# EAGLE board Flight-Mill-Battery (EAGLE 9.6.2)
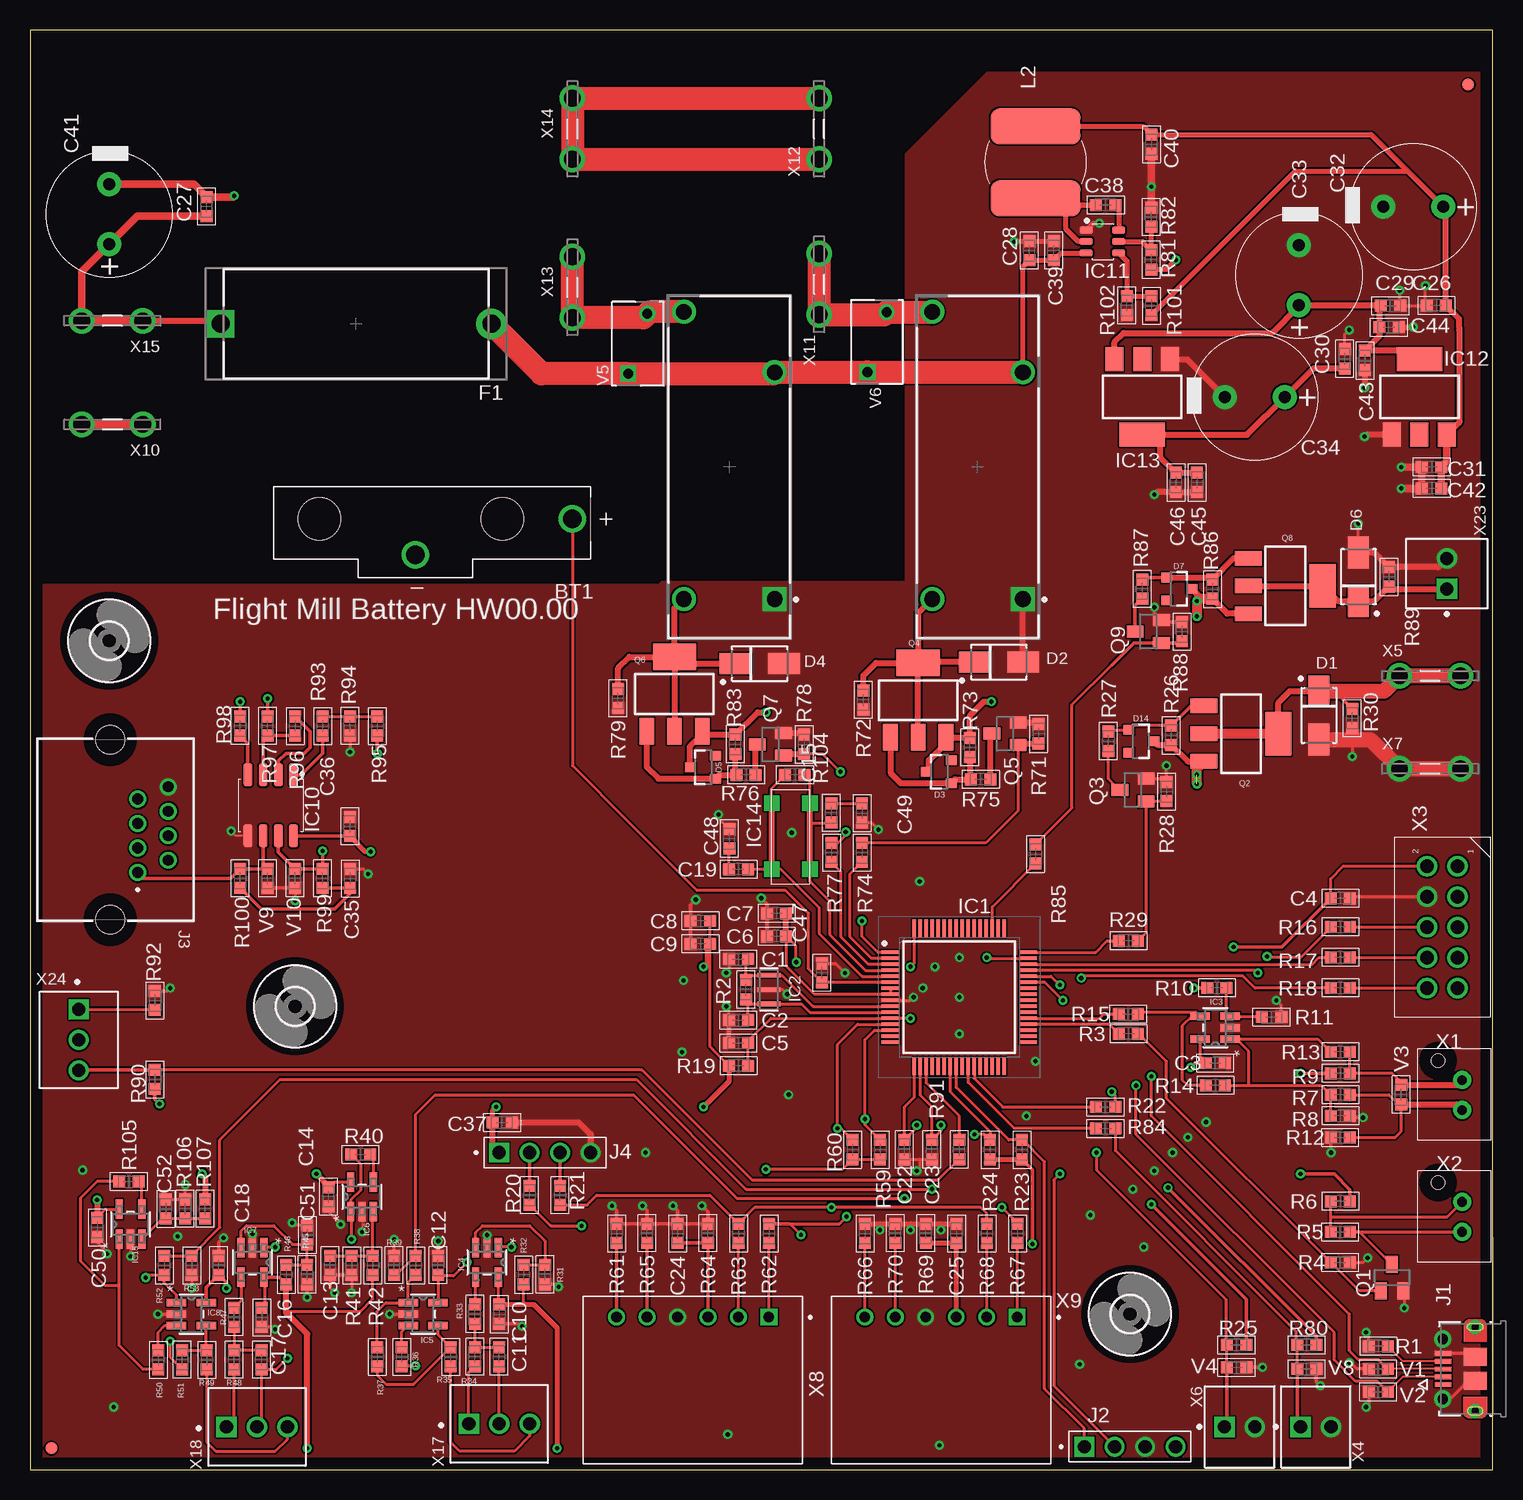
[diagram p5: board, top side]
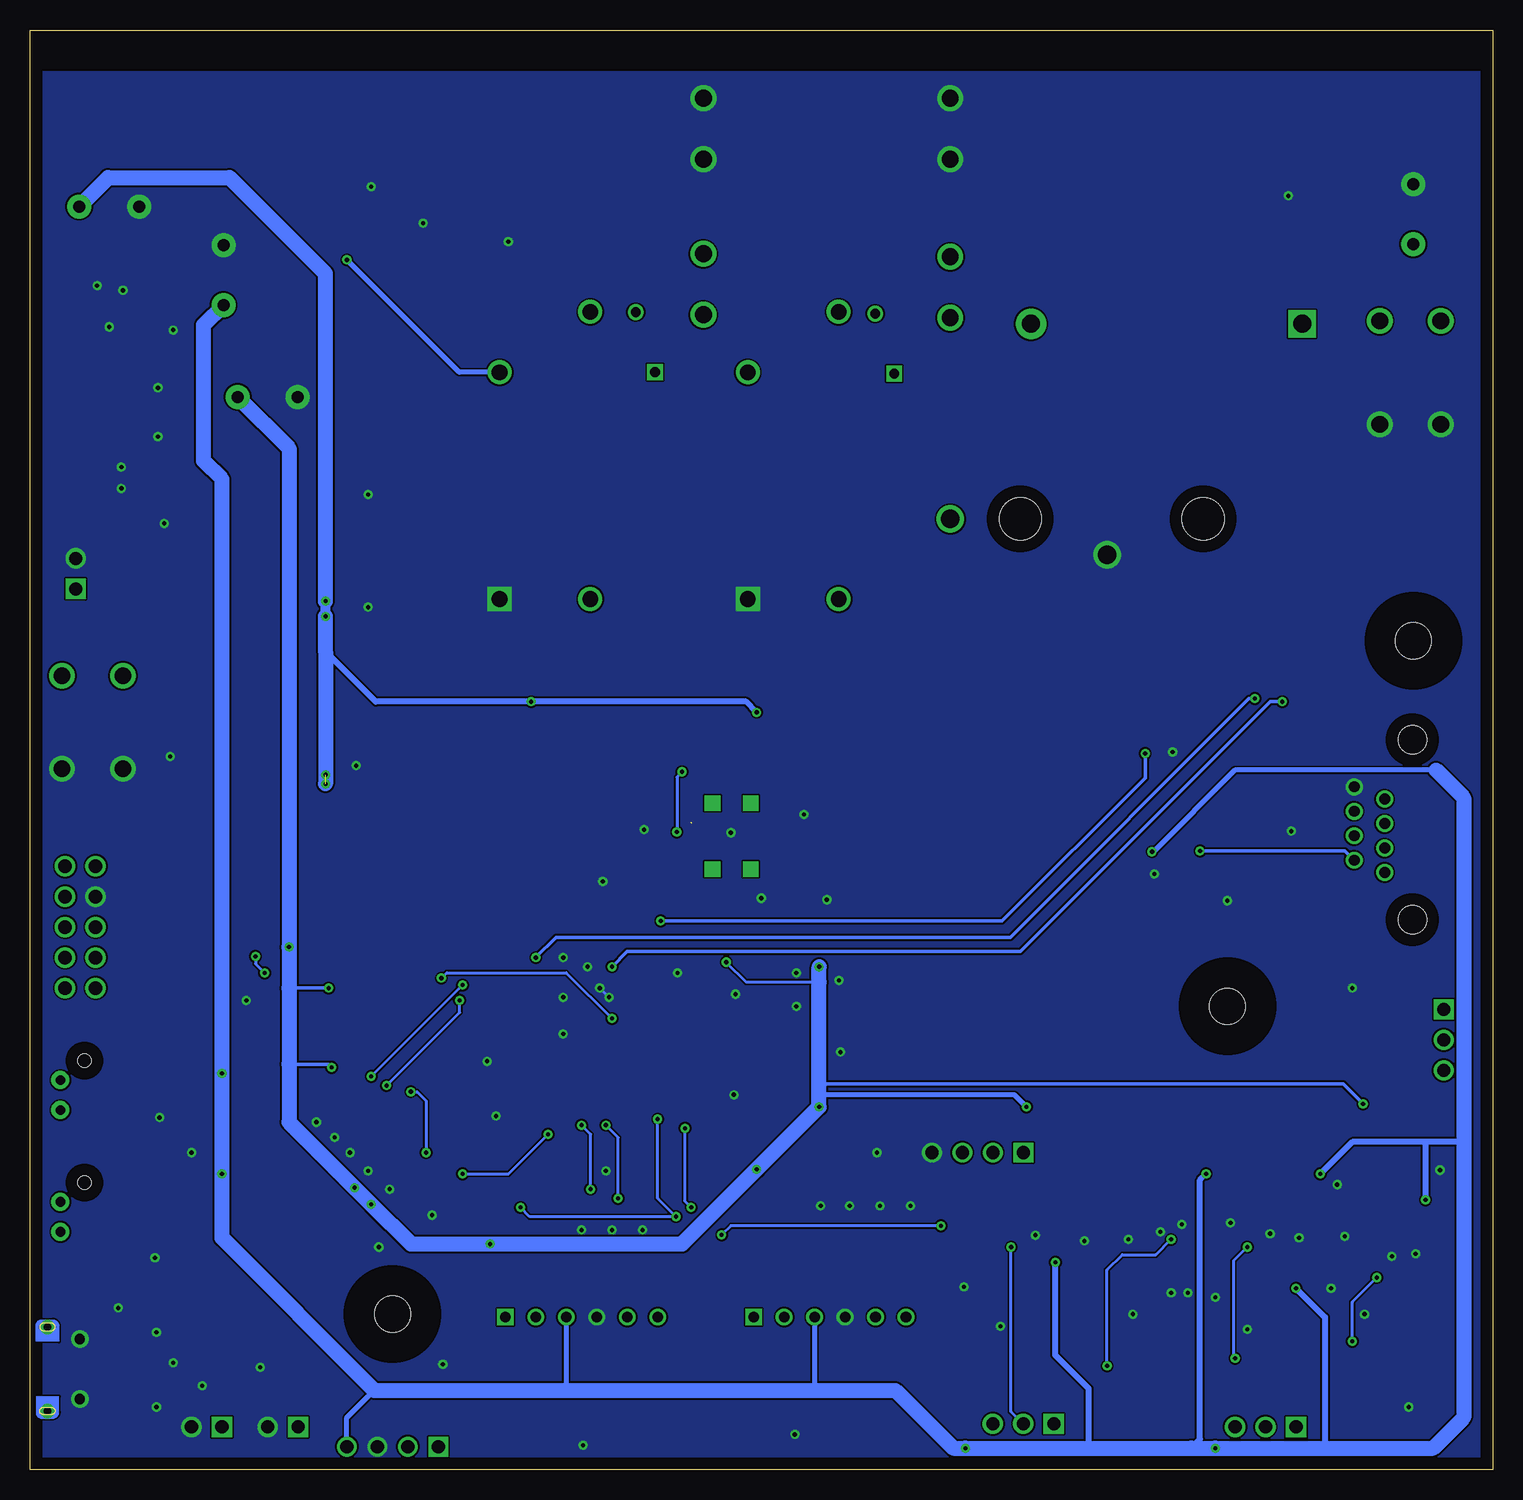
[diagram p6: board, bottom side, seen from below]

Size 121.92 x 120 mm. Coordinates in mm from the lower left corner, seen from the top.
Outline: 0,0 121.92,0 121.92,120 0,120 0,0
Copper layers (1*16): Top 0.035mm / dielectric 1.5mm / Bottom 0.035mm
Design rules "default *": minimum track width 6mil, minimum drill 0.35mm, track to track 6mil, track to pad 6mil, pad to pad 6mil, via to via 6mil, smd to smd 6mil, copper to edge 40mil, drill to drill 6mil, minimum pad ring 10mil, minimum via ring 8mil, stop-mask expansion 4mil, vias tented up to drill 0.8mm, thermal gap 10mil
Net classes: 0 default: clearance 0.152 mm; 1 Mains_N: clearance 8 mm to class 0, clearance 0.152 mm; 2 Mains_L: clearance 8 mm to class 0, clearance 3.2 mm to class 1, clearance 0.152 mm; 3 LV: clearance 0.152 mm to class 0, clearance 8 mm to class 1

## Footprints (pad centres in the part's own frame; a part is rotated, then mirrored left to right if it is on the bottom)
BAT_1065 = drill 1.52: N -0.38,3; P -13.46,0 | hole 3.5: -7.62,0; 7.62,0
EIA0603 = smd 1 x 1: 1 -0.8,0; 2 0.8,0
CAPACITOR-ELKO-RM5-10X16 = drill 1 pad 2: 1 -2.5,0; 2 2.5,0
SMA = smd 2.65 x 1.75: 1 -2.015,0; 2 2.015,0
SOT23-3 = smd 0.8 x 0.9: 1 -0.95,-1; 2 0.95,-1; 3 0,1.1
FUSE_RM22.6 = drill 1.5 pad 2.3 square: 1 -11.3,0 | drill 1.5 pad 2.54: 2 11.3,0
FIDUCIAL = smd 1 x 1: P$1 0,0
3,0 = hole 3: 0,0
QFP50P1200X1200X160-64N = smd 1.475 x 0.3: 1 -5.738,3.75; 2 -5.738,3.25; 3 -5.738,2.75; 4 -5.738,2.25; 5 -5.738,1.75; 6 -5.738,1.25; 7 -5.738,0.75; 8 -5.738,0.25; 9 -5.738,-0.25; 10 -5.738,-0.75; 11 -5.738,-1.25; 12 -5.738,-1.75; 13 -5.738,-2.25; 14 -5.738,-2.75; 15 -5.738,-3.25; 16 -5.738,-3.75; 33 5.738,-3.75; 34 5.738,-3.25; 35 5.738,-2.75; 36 5.738,-2.25; 37 5.738,-1.75; 38 5.738,-1.25; 39 5.738,-0.75; 40 5.738,-0.25; 41 5.738,0.25; 42 5.738,0.75; 43 5.738,1.25; 44 5.738,1.75; 45 5.738,2.25; 46 5.738,2.75; 47 5.738,3.25; 48 5.738,3.75 | smd 0.3 x 1.475: 17 -3.75,-5.738; 18 -3.25,-5.738; 19 -2.75,-5.738; 20 -2.25,-5.738; 21 -1.75,-5.738; 22 -1.25,-5.738; 23 -0.75,-5.738; 24 -0.25,-5.738; 25 0.25,-5.738; 26 0.75,-5.738; 27 1.25,-5.738; 28 1.75,-5.738; 29 2.25,-5.738; 30 2.75,-5.738; 31 3.25,-5.738; 32 3.75,-5.738; 49 3.75,5.738; 50 3.25,5.738; 51 2.75,5.738; 52 2.25,5.738; 53 1.75,5.738; 54 1.25,5.738; 55 0.75,5.738; 56 0.25,5.738; 57 -0.25,5.738; 58 -0.75,5.738; 59 -1.25,5.738; 60 -1.75,5.738; 61 -2.25,5.738; 62 -2.75,5.738; 63 -3.25,5.738; 64 -3.75,5.738
CSTNE8M00G520000R0 = smd 0.4 x 1.9: 1 -1.2,0; 2 0,0; 3 1.2,0
SOT-23-5 = smd 1.626 x 0.61: 1 -1.245,0.95; 2 -1.245,0; 3 -1.245,-0.95; 4 1.245,-0.95; 5 1.245,0.95
SOIC8 = smd 1.9 x 0.72: 1 -2.54,1.905; 2 -2.54,0.635; 3 -2.54,-0.635; 4 -2.54,-1.905; 5 2.54,-1.905; 6 2.54,-0.635; 7 2.54,0.635; 8 2.54,1.905
SOT23-6 = smd 0.6 x 1.1: 1 -0.95,-1.35; 2 0,-1.35; 3 0.95,-1.35; 4 0.95,1.35; 5 0,1.35; 6 -0.95,1.35
SOT223 = smd 1.5 x 2: 1 -2.3,-3.15; 2 0,-3.15; 3 2.3,-3.15 | smd 3.8 x 2: 4 0,3.15
G43270019 = drill 0 pad 1.3 square: 1 0,0; 2 5.5,0; 3 5.5,3.2; 4 0,3.2
MOLEX_1050170001 = smd 0.4 x 1.35: 1 -1.3,4.125; 2 -0.65,4.125; 3 0,4.125; 4 0.65,4.125; 5 1.3,4.125 | drill 0.85 pad 1.45: SH1 -2.5,4.15; SH2 2.5,4.15 | drill 0.6 pad 1.2: SH3 -3.5,1.45; SH6 3.5,1.45 | smd 1.5 x 1.9: SH4 -1,1.45; SH5 1,1.45
X04_100MIL_1ROW = drill 1.1 pad 1.45 square: 01 -3.81,0 | drill 1.1 pad 1.45: 02 -1.27,0; 03 1.27,0; 04 3.81,0
615008148521 = drill 0.9: 1 3.57,1.875; 2 2.55,4.415; 3 1.53,1.875; 4 0.51,4.415; 5 -0.51,1.875; 6 -1.53,4.415; 7 -2.55,1.875; 8 -3.57,4.415 | hole 2.36: -7.5,-0.425; 7.5,-0.425
RYA31012 = drill 1.3 pad 2: 11 7.9,-3.78; 14 12.94,3.78; A2 -11,3.78 | drill 1.3 pad 2 square: A1 -11,-3.78
SRN8040TA-220M = smd 3 x 7.5: 1 -3,0; 2 3,0
SOT23 = smd 1 x 1.4: 1 -0.95,-1.1; 2 0.95,-1.1; 3 0,1.1
SOT223' = smd 1.219 x 2.235: 1 -2.311,-3.099; 2 0,-3.099; 3 2.311,-3.099 | smd 3.6 x 2.2: 4 0,3.099
EPCOS_B72205S0271K101_0 = drill 0.8 pad 1.3 square: 1 -2.5,0.8 | drill 0.8 pad 1.3: 2 2.5,-0.8
B2B-XH-AM(LF)(SN) = drill 0.8 pad 1.5: 1 0,0; 2 2.5,0 | hole 1.1: 4.1,2
X10_100MIL_2XROW_VERT = drill 1.1 pad 1.7: 1 -5.08,1.27; 2 -5.08,-1.27; 3 -2.54,1.27; 4 -2.54,-1.27; 5 0,1.27; 6 0,-1.27; 7 2.54,1.27; 8 2.54,-1.27; 9 5.08,1.27; 10 5.08,-1.27
TE_282834-2_0 = drill 1.1 pad 1.7 square: 1 -1.27,0 | drill 1.1 pad 1.7: 2 1.27,0
TE_726386-2 = drill 1.4 pad 2.15: 1 -2.54,0; 1-2 2.54,0
TE_5-102203-3 = drill 0.889 square: 1 0,0 | drill 0.889: 2 2.54,0; 3 5.08,0; 4 7.62,0; 5 10.16,0; 6 12.7,0
TE_282834-3_0 = drill 1.1 pad 1.7 square: 1 0,2.54 | drill 1.1 pad 1.7: 2 0,0; 3 0,-2.54

## Placement (x,y rotation side)
BT1  1065  [BAT_1065]  31.75,79.25 180 top
C1  10pF/50V  [EIA0603]  59.05,42.55 0 top
C2  10pF/50V  [EIA0603]  59.05,37.47 0 top
C3  100nF/50V  [EIA0603]  98.81,33.91 0 top
C4  100nF/50V  [EIA0603]  109.22,47.62 180 top
C5  100nF/50V  [EIA0603]  59.05,35.56 0 top
C6  1uF/25V  [EIA0603]  62.23,44.45 180 top
C7  100nF/50V  [EIA0603]  62.23,46.35 180 top
C8  1uF/25V  [EIA0603]  55.88,45.72 180 top
C9  100nF/50V  [EIA0603]  55.88,43.81 180 top
C10  100nF/50V  [EIA0603]  39.12,12.95 270 top
C11  0R 1%  [EIA0603]  39.12,9.4 90 top
C12  100nF/50V  [EIA0603]  34.04,17.02 90 top
C13  100nF/50V  [EIA0603]  25.02,17.02 90 top
C14  100nF/50V  [EIA0603]  24.89,22.73 90 top
C15  10pF/50V  [EIA0603]  66.8,54.74 90 top
C16  100nF/50V  [EIA0603]  19.3,12.7 270 top
C17  0R 1%  [EIA0603]  19.3,9.14 90 top
C18  100nF/50V  [EIA0603]  15.75,17.02 90 top
C19  10pF/50V  [EIA0603]  59.05,50.04 180 top
C22  100nF/50V  [EIA0603]  72.9,26.67 90 top
C23  100nF/50V  [EIA0603]  75.18,26.67 90 top
C24  100nF/50V  [EIA0603]  53.98,19.68 270 top
C25  100nF  [EIA0603]  77.22,19.68 270 top
C26  100nF 100V  [EIA0603]  117.22,97.03 180 top
C27  100nF 100V  [EIA0603]  14.73,105.28 90 top
C28  100nF 100V  [EIA0603]  83.31,101.6 90 top
C29  100nF 100V  [EIA0603]  113.41,97.03 0 top
C30  100nF 100V  [EIA0603]  109.6,92.58 90 top
C31  100nF 100V  [EIA0603]  116.84,83.57 180 top
C32  50PX470MEFC10X20  [CAPACITOR-ELKO-RM5-10X16]  115.32,105.28 180 top
C33  50PX470MEFC10X20  [CAPACITOR-ELKO-RM5-10X16]  105.79,99.57 90 top
C34  50PX470MEFC10X20  [CAPACITOR-ELKO-RM5-10X16]  102.11,89.41 180 top
C35  100pF 100V  [EIA0603]  26.67,49.28 270 top
C36  100nF/50V  [EIA0603]  26.67,53.59 90 top
C37  100nF/50V  [EIA0603]  39.37,28.96 0 top
C38  100nF 100V  [EIA0603]  89.66,105.41 180 top
C39  1uF/35V  [EIA0603]  85.34,101.6 90 top
C40  100nF 100V  [EIA0603]  93.47,110.49 270 top
C41  50PX470MEFC10X20  [CAPACITOR-ELKO-RM5-10X16]  6.6,104.65 90 top
C42  1uF/35V  [EIA0603]  116.84,81.79 180 top
C43  100nF 100V  [EIA0603]  111.25,92.46 270 top
C44  1uF/35V  [EIA0603]  113.28,95.25 0 top
C45  100nF 100V  [EIA0603]  97.28,82.3 270 top
C46  1uF/35V  [EIA0603]  95.5,82.3 270 top
C47  100nF/50V  [EIA0603]  66.04,41.4 90 top
C48  10pF/50V  [EIA0603]  58.29,52.58 90 top
C49  10pF/50V  [EIA0603]  69.34,54.74 270 top
C50  100nF/50V  [EIA0603]  5.59,20.19 270 top
C51  100nF/50V  [EIA0603]  23.11,19.56 270 top
C52  100nF/50V  [EIA0603]  11.3,21.72 270 top
D1  SS14  [SMA]  107.44,62.87 270 top
D2  SS14  [SMA]  80.77,67.31 0 top
D3  MMBZ4696-HE3-18  [SOT23-3]  75.82,58.17 90 top
D4  SS14  [SMA]  60.83,67.18 0 top
D5  MMBZ4696-HE3-18  [SOT23-3]  56.13,58.55 90 top
D6  SS14  [SMA]  110.74,74.42 90 top
D7  MMBZ4696-HE3-18  [SOT23-3]  95.76,73.41 270 top
D14  MMBZ4696-HE3-18  [SOT23-3]  92.58,60.71 270 top
F1  696101000002  [FUSE_RM22.6]  27.18,95.5 0 top
FID1  FIDUCIAL  [FIDUCIAL]  119.89,115.44 0 top
FID2  FIDUCIAL  [FIDUCIAL]  1.78,1.78 0 top
H1  MOUNT-HOLE3.0  [3,0]  91.69,12.95 0 top
H2  MOUNT-HOLE3.0  [3,0]  6.6,69.09 0 top
H3  MOUNT-HOLE3.0  [3,0]  22.1,38.61 0 top
IC1  STM32G0B1RET6  [QFP50P1200X1200X160-64N]  77.47,39.37 0 top
IC2  CSTNE8M00G520000R0  [CSTNE8M00G520000R0]  61.59,40.01 270 top
IC3  MCP6001UT  [SOT-23-5]  98.81,36.83 180 top
IC4  LMV641  [SOT-23-5]  38.1,17.27 270 top
IC5  LMV641  [SOT-23-5]  32.77,12.95 0 top
IC6  LMV641  [SOT-23-5]  27.69,22.73 90 top
IC7  LMV641  [SOT-23-5]  18.54,17.27 270 top
IC8  LMV641  [SOT-23-5]  13.46,12.95 0 top
IC10  SN65HVD3082EDR  [SOIC8]  20.07,55.37 270 top
IC11  TPS54202DDCR  [SOT23-6]  89.41,102.36 270 top
IC12  LD117AS50TR  [SOT223]  115.82,89.41 0 top
IC13  LD117AS33TR  [SOT223]  92.71,89.41 180 top
IC14  G43270019  [G43270019]  65.02,50.04 90 top
IC15  LMV641  [SOT-23-5]  8.38,20.45 90 top
J1  1050170001  [MOLEX_1050170001]  121.92,8.38 90 top
J2  61300411121  [X04_100MIL_1ROW]  91.69,1.91 0 top
J3  615008148521  [615008148521]  7.11,53.34 270 top
J4  61300411121  [X04_100MIL_1ROW]  42.93,26.42 0 top
K1  RYA31012  [RYA31012]  78.99,83.57 90 top
K2  RYA31012  [RYA31012]  58.29,83.57 90 top
L2  SRN8040TA-220M  [SRN8040TA-220M]  83.82,108.97 90 top
Q1  BC817  [SOT23]  113.54,16 0 top
Q2  UT2955G-AA3-R  [SOT223']  100.97,61.34 270 top
Q3  2N7002  [SOT23]  91.95,56.64 90 top
Q4  UT2955G-AA3-R  [SOT223']  74.04,64.14 0 top
Q5  2N7002  [SOT23]  81.28,61.34 90 top
Q6  UT2955G-AA3-R  [SOT223']  53.72,64.64 0 top
Q7  2N7002  [SOT23]  61.72,60.45 90 top
Q8  UT2955G-AA3-R  [SOT223']  104.65,73.66 270 top
Q9  2N7002  [SOT23]  93.22,69.85 90 top
R1  100K 1%  [EIA0603]  112.39,10.29 180 top
R2  n.P  [EIA0603]  59.69,40.01 90 top
R3  470R 1%  [EIA0603]  91.57,36.32 180 top
R4  4.7K 1%  [EIA0603]  109.22,17.27 0 top
R5  10K 1%  [EIA0603]  109.22,19.81 0 top
R6  330R 1%  [EIA0603]  109.22,22.35 180 top
R7  47K 1%  [EIA0603]  109.22,31.24 180 top
R8  47K 1%  [EIA0603]  109.22,29.46 180 top
R9  33R 1%  [EIA0603]  109.22,33.02 180 top
R10  10K 1%  [EIA0603]  98.93,40.13 180 top
R11  10K 1%  [EIA0603]  103.5,37.72 0 top
R12  1K 1%  [EIA0603]  109.22,27.69 0 top
R13  n.p  [EIA0603]  109.22,34.8 180 top
R14  100K 1%  [EIA0603]  98.81,32 180 top
R15  100R 1%  [EIA0603]  91.57,37.97 0 top
R16  100R 1%  [EIA0603]  109.22,45.21 180 top
R17  100R 1%  [EIA0603]  109.22,42.67 180 top
R18  100R 1%  [EIA0603]  109.22,40.13 180 top
R19  10K 1%  [EIA0603]  59.05,33.66 180 top
R20  0R 1%  [EIA0603]  41.66,22.86 90 top
R21  0R 1%  [EIA0603]  44.2,22.86 90 top
R22  100R 1%  [EIA0603]  89.66,30.23 0 top
R23  10K 1%  [EIA0603]  82.68,26.67 270 top
R24  10K 1%  [EIA0603]  80.01,26.67 270 top
R25  10k 1%  [EIA0603]  100.58,10.41 0 top
R26  10K 1%  [EIA0603]  95.12,61.21 270 top
R27  10K 1%  [EIA0603]  89.92,60.71 90 top
R28  10K 1%  [EIA0603]  94.74,56.52 270 top
R29  100R 1%  [EIA0603]  91.57,44.07 180 top
R30  10K 1%  [EIA0603]  110.24,62.61 90 top
R31  10K 1%  [EIA0603]  42.93,16.26 90 top
R32  10K 1%  [EIA0603]  41.15,16.26 270 top
R33  100R 1%  [EIA0603]  37.08,12.95 90 top
R34  100R 1%  [EIA0603]  37.08,9.4 90 top
R35  100R 1%  [EIA0603]  35.05,9.4 270 top
R36  100R 1%  [EIA0603]  30.99,9.4 270 top
R37  10K 1%  [EIA0603]  28.96,9.4 270 top
R38  10K 1%  [EIA0603]  32.13,17.02 270 top
R39  n.P  [EIA0603]  30.35,17.02 90 top
R40  10R 1%  [EIA0603]  27.56,26.29 0 top
R41  2.49KK 1%  [EIA0603]  26.8,17.02 270 top
R42  2.49K 1%  [EIA0603]  28.57,17.02 270 top
R45  10K 1%  [EIA0603]  23.11,16.26 90 top
R46  10K 1%  [EIA0603]  21.34,16.26 270 top
R47  10K 1%  [EIA0603]  17.02,12.7 90 top
R48  10K 1%  [EIA0603]  17.02,9.14 90 top
R49  100R 1%  [EIA0603]  14.73,9.14 270 top
R50  100R 1%  [EIA0603]  10.67,9.14 270 top
R51  10K 1%  [EIA0603]  12.7,9.14 90 top
R52  10k 1%  [EIA0603]  11.18,17.02 270 top
R53  n.P  [EIA0603]  13.46,17.02 270 top
R59  10K 1%  [EIA0603]  70.87,26.67 270 top
R60  10K 1%  [EIA0603]  68.58,26.67 270 top
R61  0R 1%  [EIA0603]  48.9,19.68 270 top
R62  0R 1%  [EIA0603]  61.59,19.68 270 top
R63  0R 1%  [EIA0603]  59.05,19.68 270 top
R64  10K 1%  [EIA0603]  56.52,19.68 90 top
R65  10K  [EIA0603]  51.44,19.68 90 top
R66  0R 1%  [EIA0603]  69.6,19.68 270 top
R67  0R 1%  [EIA0603]  82.3,19.68 270 top
R68  0R 1%  [EIA0603]  79.76,19.68 270 top
R69  10K 1%  [EIA0603]  74.68,19.68 90 top
R70  10K  [EIA0603]  72.14,19.68 90 top
R71  10K 1%  [EIA0603]  84.07,61.34 270 top
R72  10K 1%  [EIA0603]  69.47,64.14 90 top
R73  10K 1%  [EIA0603]  78.36,60.2 90 top
R74  100R 1%  [EIA0603]  69.34,51.44 270 top
R75  10K 1%  [EIA0603]  79.25,57.53 180 top
R76  10K 1%  [EIA0603]  59.69,57.91 180 top
R77  100R 1%  [EIA0603]  66.8,51.44 270 top
R78  10K 1%  [EIA0603]  64.52,60.45 270 top
R79  10K 1%  [EIA0603]  49.02,64.26 90 top
R80  10k 1%  [EIA0603]  106.43,10.41 0 top
R81  1k 1%  [EIA0603]  93.47,100.84 90 top
R82  10k 1%  [EIA0603]  93.47,104.39 90 top
R83  10K 1%  [EIA0603]  58.8,60.45 90 top
R84  100R 1%  [EIA0603]  89.66,28.45 0 top
R85  100R 1%  [EIA0603]  83.82,51.31 270 top
R86  10K 1%  [EIA0603]  98.55,73.41 270 top
R87  10K 1%  [EIA0603]  92.71,73.41 90 top
R88  10K 1%  [EIA0603]  96.01,69.85 270 top
R89  10K 1%  [EIA0603]  113.28,74.42 270 top
R90  1K 1%  [EIA0603]  10.41,32.51 270 top
R91  100R 1%  [EIA0603]  77.47,26.67 90 top
R92  0R 1%  [EIA0603]  10.41,39.12 270 top
R93  1K 1%  [EIA0603]  24.38,61.98 270 top
R94  1.8K 1%  [EIA0603]  26.67,61.98 90 top
R95  470R 1%  [EIA0603]  28.96,61.98 270 top
R96  0R 1%  [EIA0603]  22.1,61.98 270 top
R97  470R 1%  [EIA0603]  19.81,61.98 90 top
R98  470R 1%  [EIA0603]  17.53,61.98 90 top
R99  100R 1%  [EIA0603]  24.38,49.28 90 top
R100  100R 1%  [EIA0603]  17.53,49.28 90 top
R101  100k 1%  [EIA0603]  93.47,97.03 270 top
R102  4.3K 1%  [EIA0603]  91.44,97.03 90 top
R104  22k 1%  [EIA0603]  63.75,57.91 180 top
R105  10R 1%  [EIA0603]  8.26,24 0 top
R106  2.49K 1%  [EIA0603]  12.95,21.72 90 top
R107  2.49K 1%  [EIA0603]  14.61,21.72 90 top
V1  0603ESDA-24NSMD  [EIA0603]  112.39,8.38 0 top
V2  0603ESDA-24NSMD  [EIA0603]  112.39,6.48 0 top
V3  0603ESDA-24NSMD  [EIA0603]  114.3,31.24 90 top
V4  0603ESDA-24NSMD  [EIA0603]  100.58,8.51 0 top
V5  B72205S0271K101B72205S2131K101  [EPCOS_B72205S0271K101_0]  50.67,93.85 90 top
V6  B72205S0271K101B72205S2131K101  [EPCOS_B72205S0271K101_0]  70.61,93.98 90 top
V8  0603ESDA-24NSMD  [EIA0603]  106.43,8.38 0 top
V9  0603ESDA-24NSMD  [EIA0603]  19.81,49.28 90 top
V10  0603ESDA-24NSMD  [EIA0603]  22.1,49.28 90 top
X1  B2B-XH-AM(LF)(SN)  [B2B-XH-AM(LF)(SN)]  119.38,29.97 90 top
X2  B2B-XH-AM(LF)(SN)  [B2B-XH-AM(LF)(SN)]  119.38,19.81 90 top
X3  WF2549-2WS05S0B01  [X10_100MIL_2XROW_VERT]  117.73,45.21 270 top
X4  282834-2  [TE_282834-2_0]  107.19,3.56 0 top
X5  726386-2TE_726386-2  [TE_726386-2]  116.71,66.17 0 top
X6  282834-2  [TE_282834-2_0]  100.84,3.56 0 top
X7  726386-2TE_726386-2  [TE_726386-2]  116.71,58.42 0 top
X8  5-102203-3  [TE_5-102203-3]  61.59,12.7 180 top
X9  5-102203-3  [TE_5-102203-3]  82.3,12.7 180 top
X10  726386-2TE_726386-2  [TE_726386-2]  6.86,87.12 180 top
X11  726386-2TE_726386-2  [TE_726386-2]  65.79,98.81 90 top
X12  726386-2TE_726386-2  [TE_726386-2]  65.79,111.76 90 top
X13  726386-2TE_726386-2  [TE_726386-2]  45.21,98.55 90 top
X14  726386-2TE_726386-2  [TE_726386-2]  45.21,111.76 90 top
X15  726386-2TE_726386-2  [TE_726386-2]  6.86,95.76 180 top
X17  282834-3  [TE_282834-3_0]  39.12,3.81 90 top
X18  282834-3  [TE_282834-3_0]  18.92,3.56 90 top
X23  282834-2  [TE_282834-2_0]  118.11,74.68 90 top
X24  282834-3  [TE_282834-3_0]  4.06,35.81 0 top

## Tracks (layer width: path | path; a pad name or v marks a point on that pad's centre or on a via)
AI_O2_SENSOR
  Top 0.254: R37.1 28.96,13.21 29.65,13.9 IC5.1 31.52,15.61 R38.2
AI_O2_SENSOR1  (via drill 0.35)
  Top 0.254: 30.61,16.22 R39.1 30.53,16.22 R38.1 32.13,29.59 33.78,31.24 50.29,31.24 58.93,22.61 v72.9,22.61 | IC1.17 73.72,31.05 72.9,30.23 C22.2 73.91,28.49 v73.91,28.7
  Bottom 0.254: v72.9,22.61 72.9,27.69 v73.91,28.7
AI_O2_SENSOR2  (via drill 0.35)
  Top 0.254: R52.1 R53.1 15.83,20.19 15.83,27.48 20.87,32.51 50.55,32.51 59.69,23.37 v75.18,23.37 | IC1.18 74.22,31.19 75.18,30.23 C23.2 75.95,28.23 v75.95,28.7
  Bottom 0.254: v75.95,28.7 75.18,27.94 v75.18,23.37
AIR_PUMP+
  Top 0.305: R30.2 108.77,64.88 D1.1
  Top 0.508: Q2.4 104.06,63.93 105.01,64.88 D1.1
  Top 0.813: Q2.2 Q2.4
  Top 1.27: X5.1 X5.1-2 | 114.17,65.77 X5.1 | D1.1 112.89,64.88 X5.1
CO2_SCL  (via drill 0.35)
  Top 0.254: R60.1 67.6,28.45 v67.31,28.45 67.31,35.43 69,37.12 IC1.13 | R68.1 79.76,21.34 79.25,21.84 v66.8,21.84 60.41,21.84 R63.1 56.68,22.86 47.24,22.86 46.44,22.06 R21.1
  Bottom 0.254: v66.8,21.84 67.31,22.35 v67.31,28.45
CO2_SDA  (via drill 0.35)
  Top 0.254: v68.07,21.08 67.47,20.48 R62.1 63.34,20.48 v64.26,19.56 | R59.1 69.6,28.74 v69.6,29.21 69.6,35.81 70.4,36.62 IC1.14 | v81.03,21.84 82.3,20.57 R67.1 | R20.1 43.4,20.32 v45.97,20.32
  Bottom 0.254: v69.6,29.21 69.6,22.61 v68.07,21.08 80.26,21.08 v81.03,21.84 | v45.97,20.32 63.5,20.32 v64.26,19.56
DGB_SWDCLK_TCK
  Top 0.254: IC1.46 106.89,42.12 107.44,42.67 R17.2
DGB_SWDIO_TMS  (via drill 0.35)
  Top 0.254: R16.2 108.42,45.17 105.92,42.67 103.12,42.67 v103.12,42.78 | v102.36,41.4 102.14,41.62 IC1.45
  Bottom 0.254: v103.12,42.78 103.12,42.16 v102.36,41.4
DI_PULSE1
  Top 0.254: IC1.37 88.14,37.59 89.15,37.59 89.53,37.97 R15.1
DI_PUSHBUTTON1
  Top 0.254: IC1.27 78.72,32.6 81.09,30.23 R22.1
DI_PUSHBUTTON2
  Top 0.254: R84.1 82.04,28.45 78.22,32.27 IC1.26
DI_USART_RX  (via drill 0.35)
  Top 0.254: IC1.1 70.67,43.12 69.34,44.45 v69.34,45.72
  Top 0.305: R95.2 v28.96,59.69
  Bottom 0.305: v28.96,59.69 28.96,57.66 40.89,45.72 v69.34,45.72
DO_AIR_PUMP_ON
  Top 0.254: IC1.48 88.84,43.12 89.79,44.07 R29.2
DO_FAN_ON
  Top 0.254: IC1.51 80.22,46.91 R85.2
DO_HEATER_ON
  Top 0.254: IC1.2 70.16,42.62 68.33,44.45 68.33,49.62 R74.2
DO_HUMIDIFIER_ON
  Top 0.254: IC1.3 69.89,42.12 67.56,44.45 67.56,49.87 R77.2
DO_IR_TX
  Top 0.254: R3.2 89.97,37.12 IC1.36
DO_USART_TX  (via drill 0.35)
  Top 0.254: v73.41,41.91 73.72,42.22 IC1.64
  Top 0.305: R98.2 v17.53,64.01
  Bottom 0.305: v73.41,41.91 72.14,43.18 39.37,43.18 18.54,64.01 v17.53,64.01
DO_USART_TX_EN  (via drill 0.35)
  Top 0.254: 79.81,42.62 IC1.47
  Top 0.305: v79.76,42.67 79.81,42.62 | R97.2 v19.81,64.26
  Bottom 0.305: v79.76,42.67 78.05,44.37 40.21,44.37 20.32,64.26 v19.81,64.26
FAN+
  Top 0.508: X23.1 113.5,73.41 R89.2 112.07,72.41 D6.1 109,72.41 Q8.4 Q8.2
GND  (via drill 0.35)
  Top 0.152: IC10.5 17.14,52.83 v16.76,53.21 | IC6.2 v27.69,19.81
  Top 0.254: C4.1 110.15,47.75 X3.4 | C2.1 58.26,38.39 v58.04,38.61 | C1.1 58.26,41.62 v58.04,41.4 | IC2.2 62.74,40.01 v63.12,39.62 | C22.1 74.17,25.87 | 74.17,25.87 C23.1 | 74.17,25.87 74.17,25.15 v73.91,24.89 | V2.1 111.59,5.42 v111.38,5.21 | V1.1 110.62,8.38 110.11,8.89 v109.98,8.89 | R1.2 111.59,11.21 v111.38,11.43 | Q1.2 114.55,14.84 v114.55,13.46 | R4.2 111.12,17.27 v111.51,17.65 | R11.2 104.31,38.7 v103.89,39.12 | R28.1 94.74,57.4 | 94.74,57.4 v94.74,58.67 | Q3.2 94.55,57.59 94.74,57.4 | 110.11,60.85 110.24,60.72 v110.24,59.44 | v116.33,98.68 116.33,97.12 C26.2 C29.2 114.17,97.07 v114.17,98.3 | C30.2 109.6,94.61 v109.98,95 | D6.2 v110.74,78.87 | C35.1 27.77,50.08 v28.19,49.66 | V10.1 v22.1,47.42 22.1,47.37 | R92.1 11.47,39.92 v11.68,40.13 | R53.2 v13.46,15.11 | R94.1 v26.67,59.82 | IC1.9 73.41,39.12 v73.66,39.37 | C47.2 67.14,42.2 v67.94,41.4 | C49.2 70.14,53.94 v70.74,53.34 | C50.2 5.59,18.92 6.48,18.03 v6.41,17.97 | IC15.2 v8.38,17.78 | C52.1 R106.2 | R106.2 | R106.2 v12.95,23.75 | C14.1 24.89,21.46 v25.91,20.45 | C51.1 22.06,20.36 v21.84,20.57 | R41.2 C13.1 25.02,15.11 v25.4,14.73 | R41.2 | R41.2 v26.8,14.73 | R39.2 v30.35,19.18 | C48.2 57.4,54.27 v57.4,54.61
  Top 0.305: V9.1 V10.1 | J1.5 120.17,9.68 J1.SH5 | J1.SH1 118.4,5.88 119.9,7.38 J1.SH4 | R31.1 43.85,15.46 v44.07,15.24 | C10.2 40.8,12.15 v41.02,11.94 | IC5.2 v29.97,12.95 | v34.04,19.05 C12.2 | R45.1 v23.11,14.35 | C16.2 20.23,11.9 v20.45,11.68 | IC8.2 v10.67,12.95 | v16.13,19.3 15.75,18.92 C18.2 | IC7.2 v18.54,19.66 18.54,19.68 | V4.2 v102.74,8.51 | V8.2 107.23,7.33 v107.57,6.99 | R12.1 108.42,26.45 v108.46,26.42 | R8.1 110.15,29.34 v111.12,29.34 | C6.2 C7.2 61.43,47.16 v60.96,47.62 | C9.2 C8.2 55.08,47.08 v55.5,47.5 | R64.2 R61.1 48.9,21.59 v48.51,21.97 | R64.2 | C24.1 53.98,21.59 v53.59,21.97 | R64.2 56.52,21.46 v56.01,21.97 | R65.2 51.44,21.59 v51.05,21.97 | IC4.2 v38.1,19.54 38.1,19.56 | R88.1 94.47,70.65 Q9.2 93.73,71.39 v93.73,71.88
  Top 0.406: C5.1 C2.1 | R66.1 70.87,20.48 | 70.87,20.48 73.41,20.48 | 73.41,20.48 75.82,20.48 | 75.82,20.48 C25.1 | 70.87,20.48 v70.87,19.96 70.87,19.94 | 73.41,20.48 v73.41,19.96 73.41,19.94 | 75.82,20.48 75.95,20.36 v75.95,19.96 75.95,19.94 | IC11.1 88.63,103.89 v89.15,103.89 | C39.2 C28.2 83.27,102.36 v82.04,102.36
  Top 0.508: K1.A1 82.79,72.55 D2.2 | Q5.2 83.92,62.29 R71.1 | Q7.2 64.37,61.4 R78.1 | X23.2 117.39,75.22 R89.1 112.07,76.44 D6.2 | C37.2 45.72,28.96 46.74,27.94 J4.04 | IC12.1 111.4,86.26 v111.25,86.11 | IC13.1 96.46,92.56 C34.2 | C45.2 C46.2 93.94,81.5 v93.73,81.28 | C43.2 v111.25,90.17 | C44.2 v115.32,95.25
  Top 0.61: C41.2 13.67,107.15 C27.2 16.93,106.08 v17.02,106.17 | X10.1-2 X10.1 | R82.2 v93.47,106.93 C40.2 | v114.3,83.57 C31.2 C42.2 v114.3,81.79
  Top 1.27: X7.1-2 X7.1 111.74,60.85 110.11,60.85 D1.2
  Top 1.905: X12.1 X14.1 X14.1-2 X12.1-2
  Bottom 0.254: v73.66,39.37 v74.42,40.13
  other vias: 75.44,41.91 77.47,39.37 77.47,42.67 77.47,36.32 51.31,26.42 63.25,31.24 74.17,49.02 83.06,29.46 91.95,23.37 93.73,24.89 95.25,26.42 96.52,27.69 98.04,28.96 54.36,34.8 54.48,40.77 83.82,34.04 88.39,21.21 92.84,18.54 87.5,8.76 75.82,2.03 58.17,2.92 6.99,5.21 12.32,19.43 4.38,24.96 63.5,53.09
  pour Top (no thermals): 0.38,73.79 52.45,73.79 52.7,74.04 73.03,74.04 73.03,109.67 79.81,116.46 121.28,116.46 121.28,0.64 121.03,0.38 0.89,0.38 0.38,0.89
  pour Bottom (no thermals): 0.38,0.89 0.38,116.46 121.28,116.46 121.28,0.64 121.03,0.38 0.89,0.38
HEATER+
  Top 1.905: X11.1-2 X11.1 71.2,96.27 V6.2 75.19,96.48 K1.14
HUMIDIFIER+
  Top 1.905: K2.14 51.63,96.51 V5.2 51.13,96.01 X13.1 X13.1-2
IR_DIODE_A
  Top 0.254: R5.1 108.42,21.08 | 108.42,21.08 R6.2 | R6.2 | 108.42,21.08 118.15,21.08 X2.2
IR_DIODE_C
  Top 0.254: X2.1 R5.2 110.83,19.81 Q1.3
IR_TR_NPN_C
  Top 0.254: 114.55,32.04 113.58,33.02 R9.1 R13.1
  Top 0.508: V3.2 114.55,32.04 118.95,32.04 X1.2
IR_TR_NPN_E
  Top 0.254: 110.02,30.77 R7.1 113.28,31.24 114.08,30.44 V3.1 114.3,28.19 113.79,27.69 R12.2
  Top 0.508: V3.1 118.91,30.44 X1.1
LCD_SCL
  Top 0.254: J2.01 87.88,3.43 84.58,6.73 84.58,25.65 82.77,27.47 R23.1 81.58,27.47 77.22,31.83 IC1.24
LCD_SDA  (via drill 0.35)
  Top 0.254: J2.02 85.34,6.99 85.34,24.13 v85.85,24.64 85.85,24.68 | v78.74,27.94 79.54,27.94 R24.1 80.01,28.19 76.72,31.48 IC1.23
  Bottom 0.254: v85.85,24.64 82.04,24.64 v78.74,27.94
N$1
  Top 0.254: R16.1 X3.6
N$2
  Top 0.254: R27.2 90.07,61.66 D14.1 91.99,62.06 95.17,62.06
  Top 0.305: R26.1 95.17,62.06 96.76,63.65 Q2.1
N$3
  Top 0.254: C1.2 59.69,42.38 R2.2 60.09,41.2 IC2.1 62.68,41.2 65.28,38.61 71.72,38.61 IC1.10
N$4
  Top 0.152: J1.4 114.45,9.03 R1.1
N$5
  Top 0.254: IC1.11 71.71,38.1 65.02,38.1 64.32,38.8 IC2.3 60.09,38.8 R2.1 59.85,39.04 C2.2
N$6
  Top 0.254: R8.2 R7.2 107.66,32 101.6,32 | R13.2 107.34,35.88 IC3.1 100.56,35.88 101.6,34.84 101.6,32 | R14.1 101.6,32
N$7
  Top 0.254: 108.42,17.23 R4.1 | Q1.1 110.83,14.9 108.46,17.27 R4.1 | R4.1 94.74,30.95 94.74,34.04 92.46,36.32 R3.1
N$8
  Top 0.254: R11.1 102.64,37.78 IC3.3 99.73,38.1 R10.1
N$9
  Top 0.254: Q3.3 89.92,57.57 R27.1
N$10
  Top 0.254: R14.2 96.52,32 96.08,32.45 96.08,37.02 96.84,37.78 IC3.4 97.24,38.1 92.49,38.1 R15.2
N$11
  Top 0.254: R17.1 X3.8
N$12
  Top 0.254: R29.1 93.05,44.75 Q3.1 93.07,55.72 R28.2
N$13
  Top 0.254: R18.1 X3.10
N$14
  Top 0.152: R35.1 35.03,10.22
  Top 0.254: IC5.4 34.01,11.24 R35.1 32,7.15 32,7.11 29.68,7.11 28.96,7.84 R37.2
N$15
  Top 0.254: IC6.4 28.64,26.01 R40.2
N$16
  Top 0.254: R33.1 R34.2 C11.2
N$17
  Top 0.254: 37.15,13.82 R33.2 37.08,15.96 IC4.4
N$18  (via drill 0.35)
  Top 0.254: R40.1 27.56,25.49 27.56,23.29 26.74,22.46 IC6.1 26.8,21.43 v26.8,19.18 | R36.2 31.03,8.64 v32.13,8.64
  Bottom 0.254: v32.13,8.64 32.13,16.64 30.86,17.91 28.07,17.91 v26.8,19.18
N$19
  Top 0.254: R36.1 30.99,11.47 IC5.3
N$20
  Top 0.254: C19.2 58.26,51.74 C48.1
N$21
  Top 0.254: R42.1 | R42.1 28.38,18.01 | R42.1 28.57,17.91 | 28.57,17.91 28.57,21.43 IC6.3 | C13.2 R41.1 | R41.1 | R41.1 28.49,17.82 28.57,17.91
N$23
  Top 0.254: C17.2 R48.2 R47.1
N$24
  Top 0.254: IC7.4 17.59,14.07 R47.2
N$25
  Top 0.254: R49.1 14.71,9.97 IC8.4 | R51.2 R49.1 | R49.1
N$27
  Top 0.254: IC15.3 11.05,20.92 C52.2 R106.1 | R106.1 | R106.1 R107.1
N$32  (via drill 0.35)
  Top 0.254: IC8.1 12.22,14.54 11.18,15.58 R52.2 | R52.2 | R51.1 11.68,9.36 v11.68,10.68 | v11.68,10.68 | v9.65,16 9.87,16.22 R52.2
  Bottom 0.254: v11.68,10.68 11.68,13.97 v9.65,16
N$33
  Top 0.305: X8.6 R61.2
N$34
  Top 0.254: X8.1 R62.2
N$35
  Top 0.254: X8.2 R63.2
N$36
  Top 0.305: X8.5 R65.1
N$37
  Top 0.254: X9.6 R66.2
N$38
  Top 0.254: X9.1 R67.2
N$39
  Top 0.254: X9.2 R68.2
N$40
  Top 0.254: X9.5 R70.1
N$41
  Top 0.508: Q4.1 71.73,58.06 72.58,57.22 D3.1 77.13,57.53 R75.2 78.36,57.62 R73.1
N$42
  Top 0.508: R75.1 80.05,61.21 Q5.3
N$43
  Top 0.254: 82.96,60.39 Q5.1 82.38,54.95 79.67,52.23 R74.1 | R71.2 83.97,60.65
  Top 0.508: Q5.1 82.53,60.54 R71.2
N$44
  Top 0.508: Q6.1 51.41,58.57 52.38,57.6 D5.1 57.45,57.91 R76.2 58.8,58 R83.1
N$45
  Top 0.508: R76.1 60.49,60.32 Q7.3
N$46  (via drill 0.35)
  Top 0.254: R77.1 67.35,52.23 68,52.89 v68,53.16 | v67.56,58.17 66.08,59.65 R78.2
  Top 0.508: Q7.1 62.97,59.65 R78.2
  Bottom 0.254: v68,53.16 68,57.73 v67.56,58.17
N$47
  Top 0.406: IC11.5 92.75,102.36 R81.2 R82.1
N$48
  Top 0.508: R79.2 49.02,66.8 49.96,67.74 Q6.4 | Q6.4 Q6.2 | Q6.4 54.28,67.18 D4.1 | Q6.4 53.72,71.77 K2.A2
N$49
  Top 0.254: 79.21,67.31 D2.1
  Top 0.508: R72.2 69.47,66.17 70.54,67.23 Q4.4 | Q4.2 74.04,67.06 | 74.04,67.06 Q4.4 | K1.A2 74.04,71.39 Q4.4 | D2.1 74.3,67.31 74.04,67.06
N$50  (via drill 0.35)
  Top 0.254: R22.2 90.46,31.2 v90.17,31.5 | v88.9,26.42 88.9,24.98 99.68,14.21 99.68,10.52 R25.1 V4.1
  Top 0.305: X6.1 99.78,3.77 V4.1
  Bottom 0.254: v90.17,31.5 89.66,31.5 88.9,30.73 v88.9,26.42
N$51
  Top 0.254: R84.2 90.46,26.59 105.52,11.54 105.52,10.52 R80.1 V8.1
  Top 0.305: X4.1 105.63,3.85 V8.1
N$52
  Top 0.305: R87.2 92.86,74.36 D7.1
  Top 0.508: D7.1 98.4,74.36 R86.1 100.32,75.97 Q8.1
N$53
  Top 0.305: Q9.3 92.12,72.01 R87.1
N$54
  Top 0.254: R85.1 86.87,55.16 86.87,63.75 90.17,67.06
  Top 0.305: 90.17,67.06 92.01,68.9 Q9.1 95.86,68.9 R88.2
N$55
  Top 0.254: R91.2 77.47,29.46 74.72,32.21 IC1.19
N$56
  Top 0.254: R93.1 R94.2 | R94.2 | R94.2 R95.1 | R95.1
N$57
  Top 0.305: IC10.1 22.61,57.91 24.38,59.69 R93.2
N$58
  Top 0.406: C38.1 90.76,105.11 IC11.6
N$59
  Top 0.305: IC10.2 20.7,59.05 21.34,59.69 22.86,59.69 23.37,60.2 23.37,61.51 R96.1
N$60
  Top 0.305: IC10.3 19.43,60.8 R97.1 R96.2 | R96.2
N$61
  Top 0.305: IC10.4 18.16,60.54 R98.1
N$62
  Top 0.305: J4.02 R20.2
N$63
  Top 0.305: R21.2 J4.03
N$64
  Top 0.305: R99.1 C35.2 | C35.2 | C35.2 26.67,48.01 25.4,46.74 19.27,46.74 R100.1
N$65
  Top 0.254: BT1.P 45.21,58.68 50.04,53.85 55.6,48.28 62.97,48.28 64.9,46.35 64.9,41.74 C47.1 66.06,40.62 IC1.6
N$66
  Top 0.406: IC11.2 87.38,102.36 86.36,103.38 86.36,104.9 86.87,105.41 C38.2 84.38,105.41 L2.1
N$67
  Top 0.254: IC1.5 69.37,41.12 65.79,44.7 65.79,46.84 62.59,50.04 IC14.4 C19.1 | 61.82,53.21 61.7,53.34 | IC14.3 61.82,56.78 R104.2
  Top 0.508: IC14.3 61.82,53.21 IC14.4
N$68
  Top 0.406: IC11.4 91.44,100.73 R102.2 | R102.2 | R102.2 R101.1
N$69  (1 unrouted)
  Top 0.254: IC1.4 69.63,41.62 66.67,44.58 66.67,47.37 65.02,49.02 IC14.1 | 66.71,53.85 65.02,53.85 | IC14.2 65.02,57.44 R104.1
  Top 0.508: IC14.1 65.02,53.85 IC14.2
N$70
  Top 0.254: IC15.4 9.33,23.73 R105.2
N$71
  Top 0.254: R50.2 9.44,8.34 7.43,10.35 7.43,15.37 | 7.43,15.37 IC15.1 | R105.1 5.59,24 4.19,22.61 4.19,17.4 6.22,15.37 7.43,15.37
N$72
  Top 0.254: C49.1 | C15.2 C49.1
N$73
  Top 0.254: R50.1 10.67,11.43 11.24,12 IC8.3
NRST  (via drill 0.35)
  Top 0.254: C5.2 59.85,35.73 61.75,37.62 IC1.12 71.76,37.59 v73.41,37.59 | R19.1 C5.2 | C5.2 | R18.2 102.11,40.13 101.09,41.15 87.63,41.15 v87.63,40.96
  Bottom 0.254: v87.63,40.96 87.19,41.4 77.22,41.4 v73.41,37.59
O2_SENSOR1_C  (via drill 0.35)
  Top 0.152: 39.12,8.38 C11.1
  Top 0.254: X17.2 39.12,8.38 | v40.13,18.54 39.08,18.54 IC4.1
  Bottom 0.254: v40.13,18.54 40.13,4.83 X17.2
O2_SENSOR1_R
  Top 0.254: X17.1 36.58,8.09 R34.1
O2_SENSOR1_S
  Top 0.254: X17.3 41.66,2.79 40.39,1.52 35.81,1.52 35.05,2.29 R35.2
O2_SENSOR2_C  (via drill 0.35)
  Top 0.254: X18.2 19.3,3.94 C17.1 19.35,8.3 20.49,8.3 v21.46,9.27 | IC7.1 19.52,18.54 v20.45,18.54
  Bottom 0.254: v20.45,18.54 21.59,17.4 21.59,9.4 v21.46,9.27
O2_SENSOR2_R
  Top 0.254: X18.1 17.02,4.19 R48.1
O2_SENSOR2_S
  Top 0.254: X18.3 21.46,2.54 20.45,1.52 15.49,1.52 14.73,2.29 R49.2
RS485-A
  Top 0.305: J3.1 9.48,49.28 16.73,49.28 R100.2 V9.2 19.43,50.46 IC10.6
RS485-B  (via drill 0.35)
  Top 0.305: v24.38,51.56 R99.2 V10.2 20.7,51.47 IC10.7
  Bottom 0.305: v24.38,51.56 12.3,51.56 J3.2
TEMP_SENSOR_A
  Top 0.254: X24.1 10.38,38.35 R92.2
TEMP_SENSOR_C
  Top 0.254: R90.1 51.02,33.31 60.2,24.13 75.69,24.13 77.43,25.87 R91.1
  Top 0.305: X24.3 4.1,33.31 R90.1
USB_DM  (via drill 0.35)
  Top 0.152: J1.2 114.45,7.73 V2.2
  Top 0.254: V2.2 112.31,7.37 110.49,7.37 108.71,9.14 108.71,11.43 92.2,27.94 v92.2,32 | v86.11,39.12 84.6,40.62 IC1.43
  Bottom 0.254: v92.2,32 86.11,38.1 v86.11,39.12
USB_DP  (via drill 0.35)
  Top 0.152: J1.3 V1.2
  Top 0.254: V1.2 112.42,9.16 110.98,9.16 110.96,9.14 110.74,9.14 109.98,9.91 109.98,12.95 93.47,29.46 v93.47,32.77 | IC1.44 85.12,41.12 v85.85,40.39
  Bottom 0.254: v93.47,32.77 v85.85,40.39
V3V3  (via drill 0.35)
  Top 0.254: C3.1 97.56,34.35 IC3.5 | C4.2 108.42,49.24 109.47,50.29 X3.2 | C8.1 C9.1 56.68,35.27 56.9,35.05 56.9,35.01 R19.2 | IC1.7 IC1.8 65.41,39.62 63.03,42 C6.1 63.79,43.69 63.79,42.38 v63.88,42.29 | R59.2 R60.2 67.73,25.02 v61.34,25.02
  Top 0.305: R25.2 101.38,14.19 v93.47,22.1 | R80.2 107.23,11.14 v94.87,23.5 | C3.1 97.16,33.91 v96.77,33.53 | R10.2 v97.03,40.13 | C4.2 104.36,43.56 v100.33,43.56 | R23.2 83.57,24.98 v83.57,18.8 | R90.2 10.41,30.86 v10.79,30.48
  Top 0.406: R19.2 58.26,32.35 v56.13,30.23 | C9.1 56.43,43.56 56.43,42.2 v56.13,41.91 | R24.2 R23.2 | C37.1 38.57,29.93 v38.86,30.23
  Top 0.508: C30.1 106.98,91.78 C34.1 101.46,86.26 94.23,86.26 | C6.1 C7.1 | J4.01 38.57,26.96 C37.1 | IC13.4 94.23,86.26 | 94.23,86.26 94.23,84.37 C46.1 C45.1
  Bottom 0.254: v63.88,42.29 62.23,40.64 56.13,40.64
  Bottom 0.305: v96.77,33.53 97.03,33.78 100.33,33.78 | v97.03,40.13 100.33,40.13 | v10.79,30.48 12.45,32.13 56.13,32.13
  Bottom 0.406: v38.86,30.23 39.88,31.24 56.13,31.24
  Bottom 1.27: v56.13,41.91 56.13,40.64 56.13,32.13 56.13,31.24 v56.13,30.23 v61.34,25.02 67.56,18.8 v83.57,18.8 90.17,18.8 v93.47,22.1 v94.87,23.5 100.33,28.96 100.33,33.78 100.33,40.13 v100.33,43.56 100.33,85.13 C34.1
V5V0  (via drill 0.35)
  Top 0.152: 39.05,16 IC4.5
  Top 0.254: 39.05,16 39.05,13.82 C10.1 39.15,13.72 40.89,13.72 41.15,13.97 R32.2 | IC7.5 19.56,15.96 19.56,13.75 C16.1 | C50.1 6.29,21.69 IC15.5 | C12.1 34.04,16.13 | 34.04,16.13 34.04,13.93 IC5.5 | C14.2 24.94,23.58 25.34,23.98 IC6.5 | 21.34,13.08 21.46,13.21 27.56,13.21 28.57,14.22 R42.2 | v36.45,17.27 35.31,16.13 34.04,16.13
  Top 0.305: X8.3 R64.1 C24.2 | C24.2 | IC10.8 26.63,52.83 C36.1 | R6.1 110.02,23.33 108.71,24.64 v105.92,24.64 | R9.2 v105.92,33.02 | R46.2 20.77,16.03 IC7.5 | 19.41,13.4 C16.1 | v16.38,15.11 16.38,15.58 C18.1 14.71,15.18 IC8.5 15.17,13.9
  Top 0.406: v28.38,51.5 27.97,51.5 C36.1 | C10.1 42,13.75 43.94,11.81 v43.94,1.78 | R69.1 | R69.1 C25.2 X9.3
  Top 0.508: v23.11,1.78 23.11,11.3 21.34,13.08 R46.2 | IC12.4 115.13,93.26 C43.1 112.48,94.49 C44.1 112.48,96.9 C29.1 112.57,97.07 C33.1 105.79,96.99 103.55,94.74 91.19,94.74 90.41,93.97 IC13.3 | v23.88,24.64 24.94,23.58 | v14.35,24.64 14.61,24.38 R107.2 | v5.59,22.48 C50.1
  Bottom 0.406: 4.7,58.29 21.46,58.29 28.32,51.44 v28.38,51.5 | J2.04 95.5,4.32 93.22,6.6 | X8.3 56.52,6.6 | X9.3 77.22,6.73 77.34,6.6
  Bottom 0.508: 33.66,1.78 33.66,6.73 36.45,9.53 v36.45,17.27 | 25.15,1.78 24.38,2.54 24.38,24.13 v23.88,24.64 | 2.41,27.3 5.71,27.3 | 5.71,27.3 11.68,27.3 v14.35,24.64 | 5.71,27.3 5.59,27.18 v5.59,22.48 | v16.38,15.11 13.97,12.7 13.97,1.78
  Bottom 1.27: 4.7,58.29 2.41,56.01 2.41,27.3 2.41,4.32 4.95,1.78 13.97,1.78 v23.11,1.78 25.15,1.78 33.66,1.78 v43.94,1.78 44.96,1.78 49.78,6.6 56.52,6.6 77.34,6.6 93.22,6.6 105.92,19.3 v105.92,24.64 v105.92,33.02 105.92,82.55 107.44,84.07 107.44,95.42 C33.1
V24V0  (via drill 0.35)
  Top 0.406: K1.11 82.77,100.26 C28.1 C39.1 85.96,101.41 IC11.3 | v95.5,100.84 94.7,100.04 R81.1
  Top 1.905: K1.11 V6.1 69.8,91.47 K2.11 61.96,91.35 V5.1 42.63,91.35 F1.2
  Bottom 0.406: K1.11 86.13,91.47 v95.5,100.84
V24V0_B4_FUSE
  Top 0.508: X15.1 15.62,95.76 F1.1
  Top 0.61: X15.1 X15.1-2 4.32,99.86 C41.1 8.94,104.48 C27.1
V_12V0  (via drill 0.35)  (1 unrouted)
  Top 0.406: L2.2 92.8,111.97 C40.1 111.81,111.29 114.85,108.25 | 114.85,108.25 118.02,105.08 | R101.2 105.49,108.25 114.85,108.25
  Top 0.508: D3.3 74.93,58.38 74.93,59.11 76.35,60.53 Q4.3 78.32,61.04 R73.2 78.36,62.87 79.5,64.01 v80.14,64.01 | D5.3 55.03,60.29 56.03,61.29 Q6.3 56.33,61.25 R83.2 60.67,63.12 v61.34,63.12 | D14.3 93.97,60.41 R26.2 96.51,59.03 Q2.3 | Q8.3 99.81,71.35 R86.2 | C32.1 118.02,105.08 C26.1 119.13,95.92 119.13,95.25 119.13,95 119.13,87.26 IC12.3 | D7.3 97.28,72.98 v97.28,72.39
  Top 0.61: C42.1 C31.1 118.12,84.05 IC12.3
  Top 0.813: v97.28,57.15 97.28,58.45 Q2.3 | R86.2 97.5,72.61 v97.28,72.39 v97.28,71.12
  Bottom 0.508: v61.34,63.12 62.23,64.01 v80.14,64.01 93.09,64.01 97.28,68.2 | 97.54,56.9 v97.28,57.15
  Bottom 0.813: v97.28,71.12 v97.28,72.39
  Bottom 1.27: v97.28,71.12 97.28,68.2 v97.28,57.15 | v97.28,72.39 97.28,99.69 105.28,107.7 115.4,107.7 C32.1
  other vias: 97.28,57.91
VREF_O2_1
  Top 0.254: R46.1 R45.2 | R45.2 | IC7.3 17.59,19.88 18.03,20.32 20.32,20.32 21.88,18.76 C51.2 R45.2
VREF_O2_2
  Top 0.254: R32.1 R31.2 | R31.2 | IC4.3 37.15,19.75 37.72,20.32 41.66,20.32 42.93,19.05 R31.2

## Text on the board
tPlace: Flight Mill Battery HW00.00